# EAGLE design SpringReverbRev2.1_SMD (EAGLE 9.6.2)
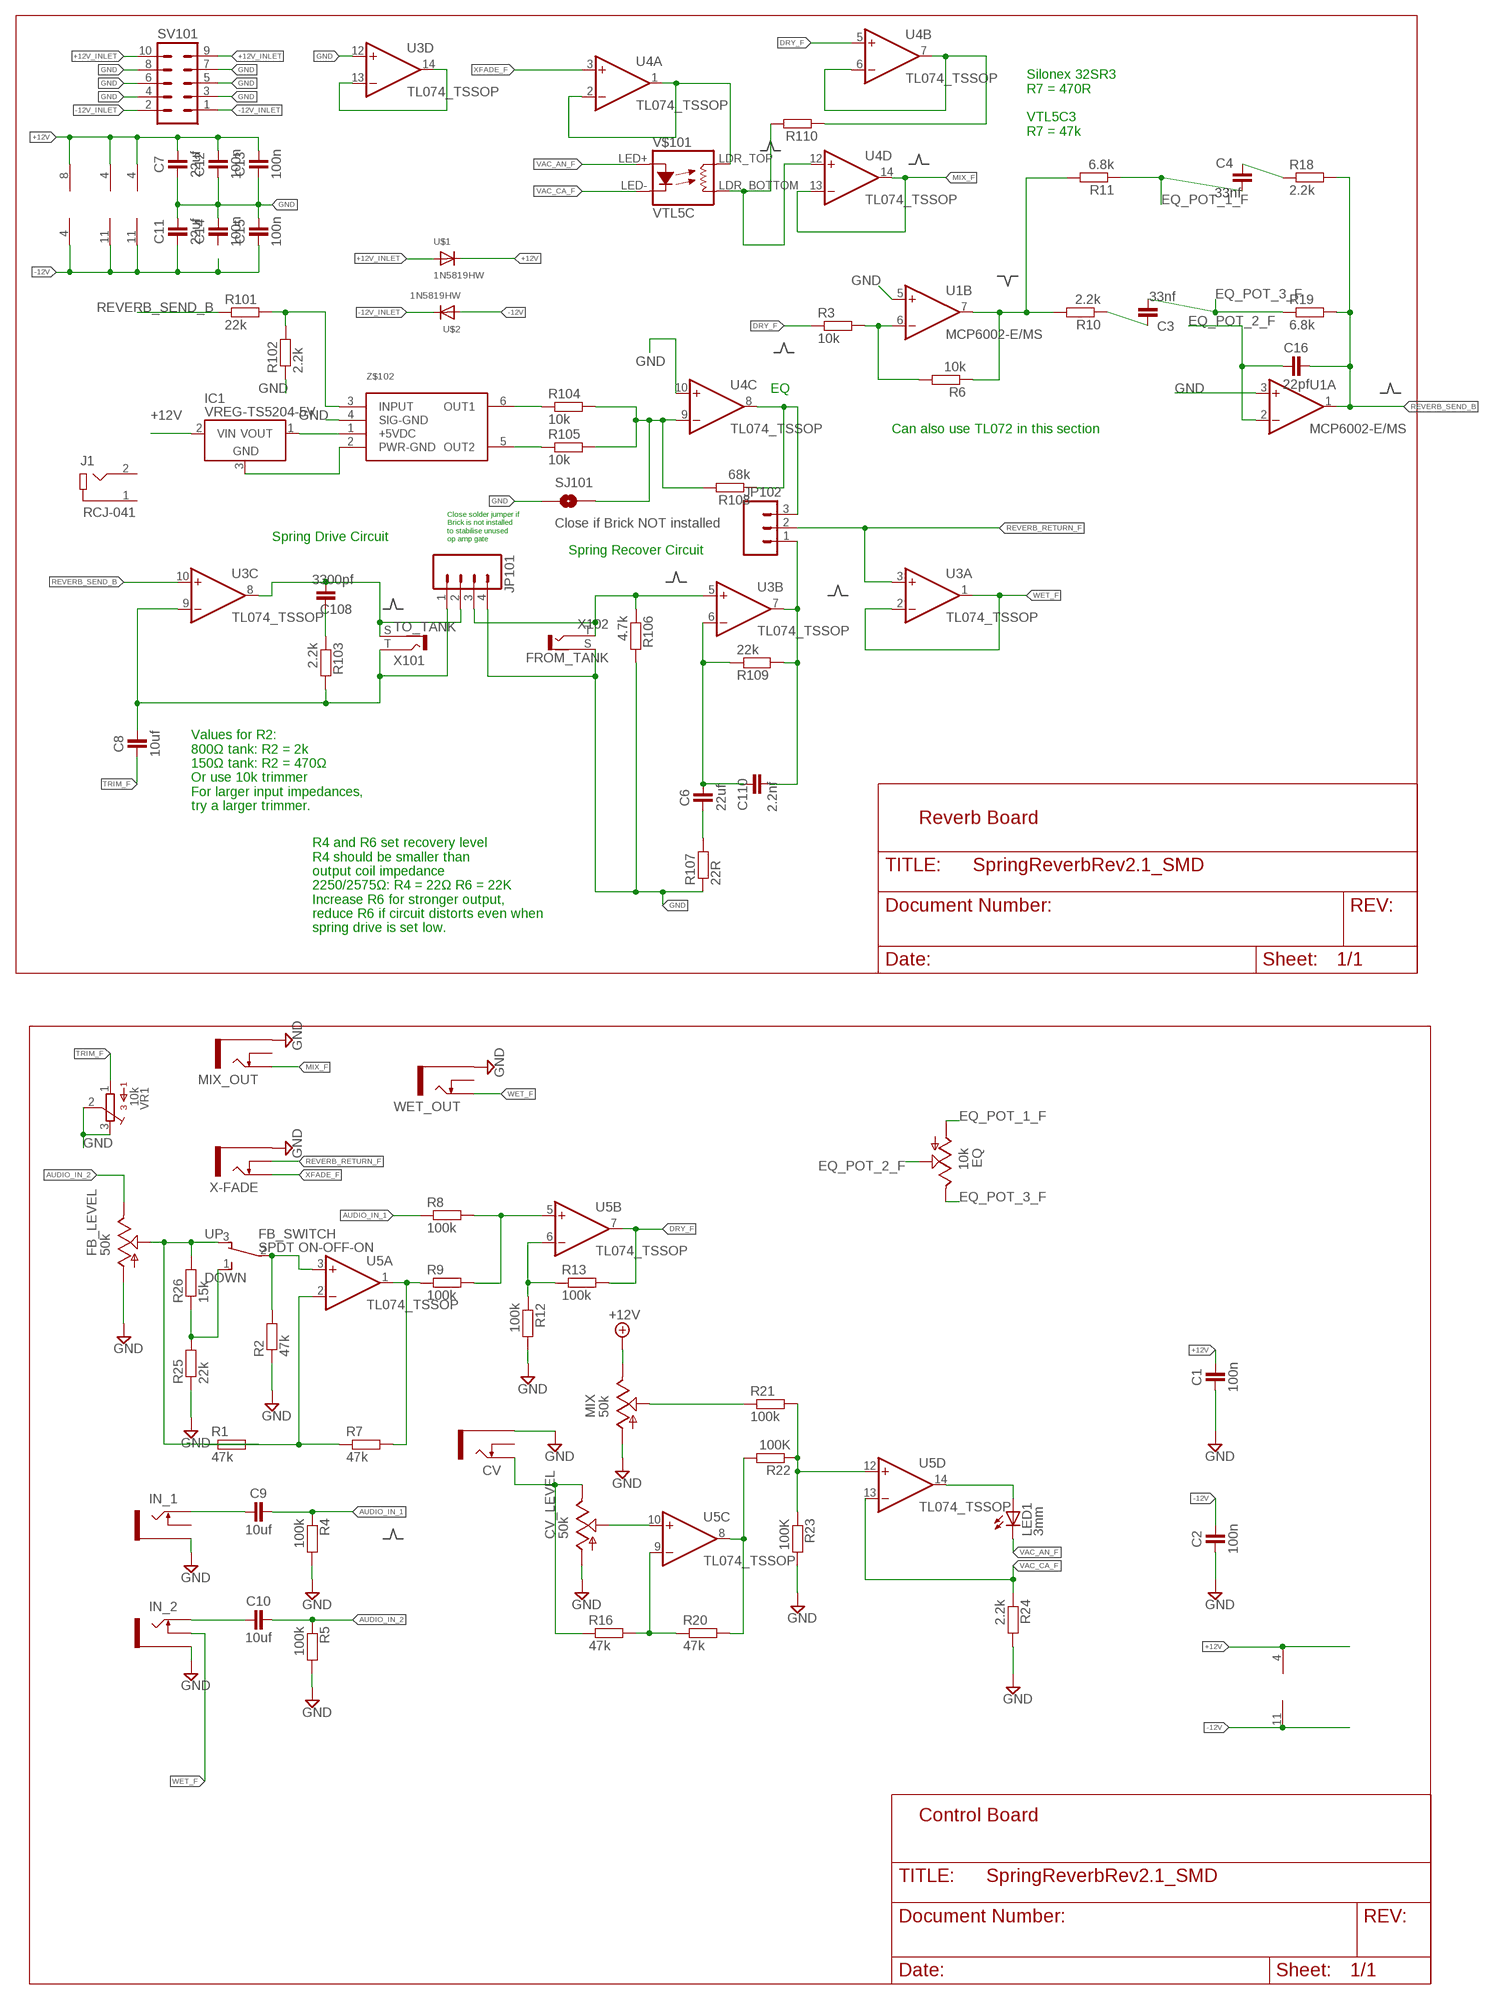
[diagram p0: schematic, sheet 1]

## Parts
C1  100n  CAPACITOR-0402  [C0402]
C2  100n  CAPACITOR-0402  [C0402]
C3  33nf  CAPACITOR-0402  [C0402]
C4  33nf  CAPACITOR-0402  [C0402]
C6  22uf  CAPACITOR-1210  [C1210]
C7  22uf  CAPACITOR-1206  [C1206]
C8  10uf  CAPACITOR-0805  [C0805]
C9  10uf  CAPACITOR-0805  [C0805]
C10  10uf  CAPACITOR-0805  [C0805]
C11  22uf  CAPACITOR-1206  [C1206]
C12  100n  CAPACITOR-0402  [C0402]
C13  100n  CAPACITOR-0402  [C0402]
C14  100n  CAPACITOR-0402  [C0402]
C15  100n  CAPACITOR-0402  [C0402]
C16  22pf  CAPACITOR-0402  [C0402]
C108  3300pf  CAPACITOR-0402  [C0402]
C110  2.2nf  CAPACITOR-0402  [C0402]
CV  THONKICONNNEW  [WQP-PJ301M-12_JACK]
CV_LEVEL  50k  ALPHA-9MMF2A  [EVUF]
EQ  10k  ALPHA-9MMF2A  [EVUF]
FB_LEVEL  50k  ALPHA-9MMF2A  [EVUF]
FB_SWITCH  SPDT ON-OFF-ON  SPDT-VERTICAL-UPTOP-SUBMINI  [SPDT-VERTICAL-TOP-SUBMINI-MULTICOMP]
IC1  VREG-TS5204-5V  [SOT23]
IN_1  THONKICONNNEW  [WQP-PJ301M-12_JACK]
IN_2  THONKICONNNEW  [WQP-PJ301M-12_JACK]
J1  RCJ-041  [RCJ-041]
JP101  M04POLAR  [MOLEX-1X4]
JP102  M03LOCK_NO_SILK  [1X03_LOCK_NO_SILK]
LED1  3mm  LED3MM  [LED3MM]
MIX  50k  ALPHA-9MMF2A  [EVUF]
MIX_OUT  THONKICONNNEW  [WQP-PJ301M-12_JACK]
R1  47k  RESISTOR-0402  [C0402]
R2  47k  RESISTOR-0402  [C0402]
R3  10k  RESISTOR-0402  [C0402]
R4  100k  RESISTOR-0402  [C0402]
R5  100k  RESISTOR-0402  [C0402]
R6  10k  RESISTOR-0402  [C0402]
R7  47k  RESISTOR-0402  [C0402]
R8  100k  RESISTOR-0402  [C0402]
R9  100k  RESISTOR-0402  [C0402]
R10  2.2k  RESISTOR-0402  [C0402]
R11  6.8k  RESISTOR-0402  [C0402]
R12  100k  RESISTOR-0402  [C0402]
R13  100k  RESISTOR-0402  [C0402]
R16  47k  RESISTOR-0402  [C0402]
R18  2.2k  RESISTOR-0402  [C0402]
R19  6.8k  RESISTOR-0402  [C0402]
R20  47k  RESISTOR-0402  [C0402]
R21  100k  RESISTOR-0402  [C0402]
R22  100K  RESISTOR-0402  [C0402]
R23  100K  RESISTOR-0402  [C0402]
R24  2.2k  RESISTOR-0402  [C0402]
R25  22k  RESISTOR-0402  [C0402]
R26  15k  RESISTOR-0402  [C0402]
R101  22k  RESISTOR-0402  [C0402]
R102  2.2k  RESISTOR-0402  [C0402]
R103  2.2k  RESISTOR-0402  [C0402]
R104  10k  RESISTOR-0402  [C0402]
R105  10k  RESISTOR-0402  [C0402]
R106  4.7k  RESISTOR-0402  [C0402]
R107  22R  RESISTOR-0402  [C0402]
R108  68k  RESISTOR-0402  [C0402]
R109  22k  RESISTOR-0402  [C0402]
R110  RESISTOR-0402  [C0402]
SJ101  Close if Brick NOT installed  SOLDERJUMPERNC2  [SJ_2S-NOTRACE]
SV101  10_PIN_HEADER  [MA05-2]
U1  MCP6002-E/MS  [SOP65P490X110-8N]
U3  TL074_TSSOP  LM324_TSSOP  [SOP65P640X120-14N]
U4  TL074_TSSOP  LM324_TSSOP  [SOP65P640X120-14N]
U5  TL074_TSSOP  LM324_TSSOP  [SOP65P640X120-14N]
U$1  1N5819HW  [SOD-123-EDITED]
U$2  1N5819HW  [SOD-123-EDITED]
V$101  VTL5C  VACTROL_COMPACT  [VACTROL_COMPACT]
VR1  10k  BOURNS_3362P_TRIMMERP  [BOURNS_3362P_TRIMMER]
WET_OUT  THONKICONNNEW  [WQP-PJ301M-12_JACK]
X101  TO_TANK  BTOR1  [BTOR1]
X102  FROM_TANK  BTOR1  [BTOR1]
X-FADE  THONKICONNNEW  [WQP-PJ301M-12_JACK]
Z$102  BTDR-2H  [BTDR-2H]

## Nets
+12V [power]: C1.2 C7.2 C12.2 C13.2 IC1.2(VIN) MIX.3(E) U1.8(PWR:V+) U3.4(PWR:V+) U4.4(PWR:V+) U5.4(PWR:V+) U$1.C
+12V_INLET: SV101.9 SV101.10 U$1.A
-12V [power]: C2.2 C11.1 C15.1 U1.4(PWR:V-) U3.11(PWR:V-) U4.11(PWR:V-) U5.11(PWR:V-) U$2.A
-12V_INLET: SV101.1 SV101.2 U$2.C
AUDIO_IN_1: C9.2 R4.1 R8.1
AUDIO_IN_2: C10.2 FB_LEVEL.3(E) R5.1
AUDIO_IN_BUF: R110.1 U4.6(B:-IN) U4.7(B:OUT)
BRK: JP102.3 R108.1 U4.8(C:OUT)
CV_F: R20.2 R22.2 U5.8(C:OUT)
DRY_F: R3.1 R13.2 U4.5(B:+IN) U5.7(B:OUT)
EQ_POT_1_F: C4.2 EQ.1(A) R11.1
EQ_POT_2_F: C16.1 EQ.2(S) U1.2(A:-IN)
EQ_POT_3_F: C3.2 EQ.3(E) R19.1
GND [ground]: C1.1 C2.1 C7.1 C11.2 C12.1 C13.1 C14.2 C15.2 CV.P$3_SLEEVE(SLEEVE) CV_LEVEL.1(A) FB_LEVEL.1(A) IN_1.P$3_SLEEVE(SLEEVE) IN_2.P$3_SLEEVE(SLEEVE) JP101.4 MIX.1(A) MIX_OUT.P$3_SLEEVE(SLEEVE) R2.1 R4.2 R5.2 R12.2 R23.2 R24.2 R25.1 R102.1 R106.2 R107.1 SJ101.1 SV101.3 SV101.4 SV101.5 SV101.6 SV101.7 SV101.8 U1.3(A:+IN) U1.5(B:+IN) U3.12(D:+IN) U4.10(C:+IN) VR1.2 VR1.3 WET_OUT.P$3_SLEEVE(SLEEVE) X102.S X-FADE.P$3_SLEEVE(SLEEVE) Z$102.4(SIG-GND)
MIX_F: MIX_OUT.P$1_TIP(TIP) U4.13(D:-IN) U4.14(D:OUT)
N$1: C9.1 IN_1.P$1_TIP(TIP)
N$2: C10.1 IN_2.P$1_TIP(TIP)
N$3: MIX.2(S) R21.1
N$4: FB_LEVEL.2(S) FB_SWITCH.3 R1.2 R26.2
N$5: R1.1 R7.1 U5.2(A:-IN)
N$6: R7.2 R9.1 U5.1(A:OUT)
N$7: R8.2 R9.2 U5.5(B:+IN)
N$8: R21.2 R22.1 R23.1 U5.12(D:+IN)
N$9: R12.1 R13.1 U5.6(B:-IN)
N$10: CV.P$1_TIP(TIP) CV_LEVEL.3(E) R16.1
N$11: LED1.A U5.14(D:OUT)
N$12: FB_SWITCH.1 R25.2 R26.1
N$13: C3.1 R10.1
N$17: C6.1 R107.2
N$19: C6.2 C110.1 R109.1 U3.6(B:-IN)
N$20: CV_LEVEL.2(S) U5.10(C:+IN)
N$21: C4.1 R18.1
N$23: R16.2 R20.1 U5.9(C:-IN)
N$24: R3.2 R6.2 U1.6(B:-IN)
N$26: C108.1 R103.1
N$27: IC1.1(VOUT) Z$102.1(+5VDC)
N$28: R104.1 Z$102.6(OUT1)
N$29: R105.1 Z$102.5(OUT2)
N$30: R104.2 R105.2 R108.2 SJ101.2 U4.9(C:-IN)
N$31: R6.1 R10.2 R11.2 U1.7(B:OUT)
N$32: R101.2 R102.2 Z$102.3(INPUT)
N$33 [ground]: IC1.3(GND) Z$102.2(PWR-GND)
N$34 [ground]: R110.2 U4.12(D:+IN) V$101.LDR_BOTTOM(RES2)
N$35: U3.13(D:-IN) U3.14(D:OUT)
N$41: FB_SWITCH.2 R2.2 U5.3(A:+IN)
R+: JP101.3 R106.1 U3.5(B:+IN) X102.T
REVERB_RETURN_F: JP102.2 U3.3(A:+IN) X-FADE.P$2_SWITCH(SWITCH)
REVERB_SEND_B: C16.2 R18.2 R19.2 R101.1 U1.1(A:OUT) U3.10(C:+IN)
S+: C8.2 JP101.1 R103.2 U3.9(C:-IN) X101.T
S-: C108.2 JP101.2 U3.8(C:OUT) X101.S
SPNG: C110.2 JP102.1 R109.2 U3.7(B:OUT)
TRIM_F: C8.1 VR1.1
VAC_AN_F: LED1.K(C) V$101.LED+
VAC_CA_F: R24.1 U5.13(D:-IN) V$101.LED-
WET_F: IN_2.P$2_SWITCH(SWITCH) U3.1(A:OUT) U3.2(A:-IN) WET_OUT.P$1_TIP(TIP)
X_FADE_IN: U4.1(A:OUT) U4.2(A:-IN) V$101.LDR_TOP(RES1)
XFADE_F: U4.3(A:+IN) X-FADE.P$1_TIP(TIP)
Unconnected: C14.1 CV.P$2_SWITCH(SWITCH) IN_1.P$2_SWITCH(SWITCH) J1.1 J1.2 MIX_OUT.P$2_SWITCH(SWITCH) WET_OUT.P$2_SWITCH(SWITCH) X101.S@1 X101.S@2 X101.S@3 X102.S@1 X102.S@2 X102.S@3

## Notes on the sheet
- Silonex 32SR3 
  R7 = 470R
  
  VTL5C3 
  R7 = 47k
- EQ
- Can also use TL072 in this section
- Spring Drive Circuit
- Close solder jumper if 
  Brick is not installed
  to stabilise unused
  op amp gate
- Spring Recover Circuit
- Values for R2:
  800Ω tank: R2 = 2k
  150Ω tank: R2 = 470Ω
  Or use 10k trimmer
  For larger input impedances, 
  try a larger trimmer.
- Reverb Board
- R4 and R6 set recovery level 
  R4 should be smaller than 
  output coil impedance
  2250/2575Ω: R4 = 22Ω R6 = 22K 
  Increase R6 for stronger output, 
  reduce R6 if circuit distorts even when 
  spring drive is set low.
- Control Board

## Library data of the parts
C1-C4 C6-C16 C108 C110 = we-rcl:CAPACITOR: Capacitors ...2.2uF @ 6.3V -> 0402 ...4.7uF @ 6.3V -> 0603 ...10uF @ 16V -> 0805 ...22uF @ 25V -> 1206
CV IN_1 IN_2 MIX_OUT WET_OUT X-FADE = MusicThingModular:THONKICONN: 3.5mm socket for Eurorack modular synths
CV_LEVEL EQ FB_LEVEL MIX = TomW:ALPHA-9MM: 9 mm Square Rotary Potentiometers Source: Panasonic
FB_SWITCH = Monowave_Switches:SPDT-VERTICAL-UP: Vertical SPDT switch in the up position.; SPICE: R{NAME} {2.NET} {3.NET} 1
IC1 = we-power:VREG: Voltage Regulators (LDOs, Switching Converters...) LDOs Taiwan Semi TS1117 800mA max 15V - compatible On Semi NCP1117 1A max 20V Taiwan Semi TS9011 250mA max 12V - compatible Diodes AP2210 300mA max 15V - compatible Microchip MCP1702 250mA max 13V - compatible Microchip MCP1703 250mA max 16V - compatible Microchip MCP1754 150mA max 16V Taiwan Semi TS5204 150mA max 16V (low noise) DC/DC Converter Modules Recom R-78Ex.x-1.0-W36 1A max 28V Murata OKI-78SR-x.x/1.5-W36 1.5A max 36V CUI V78xx-2000 2A max 18V; NRND: NRND
J1 = Connectors:RCJ-041: CONN RCA JACK MONO 3.2MM R/A Manufacturer's datasheet <https://www.cui.com/product/resource/digikeypdf/rcj-04x.pdf>; CREATED_BY: PCBLayout.com; DIGIKEY_PART_NUMBER: CP-1418-ND; MANUFACTURER: CUI Inc.; MPN: RCJ-041
JP101 = SparkFun-Connectors:M04: Header 4 Standard 4-pin 0.1" header. Use with straight break away headers (SKU : PRT-00116), right angle break away headers (PRT-00553), swiss pins (PRT-00743), machine pins (PRT-00117), and female headers (PRT-00115). Molex polarized connector foot print use with SKU : PRT-08231 with associated crimp pins and housings. 1MM SMD Version SKU: PRT-10208
JP102 = SparkFun-Connectors:M03: Header 3 Standard 3-pin 0.1" header. Use with straight break away headers (SKU : PRT-00116), right angle break away headers (PRT-00553), swiss pins (PRT-00743), machine pins (PRT-00117), and female headers (PRT-00115). Molex polarized connector foot print use with SKU : PRT-08232 with associated crimp pins and housings.
LED1 = TomW:LED: LED OSRAM: - CHIPLED LG R971, LG N971, LY N971, LG Q971, LY Q971, LO R971, LY R971 LH N974, LH R974 LS Q976, LO Q976, LY Q976 LO Q996 - Hyper CHIPLED LW Q18S LB Q993, LB Q99A, LB R99A - SideLED LS A670, LO A670, LY A670, LG A670, LP A670 LB A673, LV A673, LT A673, LW A673 LH A674 LY A675 LS A676, LA A676, LO A676, LY A676, LW A676 LS A679, LY A679, LG A679 - Hyper Micro SIDELED® LS Y876, LA Y876, LO Y876, LY Y876 LT Y87S - SmartLED LW L88C, LW L88S LB L89C, LB L89S, LG L890 LS L89K, LO L89K, LY L89K LS L896, LA L896, LO L896, LY L896 - TOPLED LS T670, LO T670, LY T670, LG T670, LP T670 LSG T670, LSP T670, LSY T670, LOP T670, LYG T670 LG T671, LOG T671, LSG T671 LB T673, LV T673, LT T673, LW T673 LH T674 LS T676, LA T676, LO T676, LY T676, LB T676, LH T676, LSB T676, LW T676 LB T67C, LV T67C, LT T67C, LS T67K, LO T67K, LY T67K, LW E67C LS E67B, LA E67B, LO E67B, LY E67B, LB E67C, LV E67C, LT E67C LW T67C LS T679, LY T679, LG T679 LS T770, LO T770, LY T770, LG T770, LP T770 LB T773, LV T773, LT T773, LW T773 LH T774 LS E675, LA E675, LY E675, LS T675 LS T776, LA T776, LO T776, LY T776, LB T776 LHGB T686 LT T68C, LB T68C - Hyper Mini TOPLED® LB M676 - Mini TOPLED Santana® LG M470 LS M47K, LO M47K, LY M47K Source: http://www.osram.convergy.de LUXEON: - LUMILED® LXK2-PW12-R00, LXK2-PW12-S00, LXK2-PW14-U00, LXK2-PW14-V00 LXK2-PM12-R00, LXK2-PM12-S00, LXK2-PM14-U00 LXK2-PE12-Q00, LXK2-PE12-R00, LXK2-PE12-S00, LXK2-PE14-T00, LXK2-PE14-U00 LXK2-PB12-K00, LXK2-PB12-L00, LXK2-PB12-M00, LXK2-PB14-N00, LXK2-PB14-P00, LXK2-PB14-Q00 LXK2-PR12-L00, LXK2-PR12-M00, LXK2-PR14-Q00, LXK2-PR14-R00 LXK2-PD12-Q00, LXK2-PD12-R00, LXK2-PD12-S00 LXK2-PH12-R00, LXK2-PH12-S00 LXK2-PL12-P00, LXK2-PL12-Q00, LXK2-PL12-R00 Source: www.luxeon.com KINGBRIGHT: KA-3528ASYC Source: www.kingbright.com
R1-R13 R16 R18-R26 R101-R110 = we-rcl:RESISTOR: Resistors all kinds in 0402 and 0603
SJ101 = SparkFun-Passives:SOLDERJUMPER: Solder Jumper Standard SMD solder jumper. Used to automate production. Two varients : Normally Open and Normally Closed are the same, but have different paste layers. NC will have a large amount of paste and should jumper during reflow.
SV101 = TomW:10_PIN_HEADER: PIN HEADER; OC_FARNELL: unknown; OC_NEWARK: unknown
U1 = MTM_untested:MCP6002-E/MS: Low-Power Op Amp; MPN: MCP6002-E/MS; OC_FARNELL: 1840886; OC_NEWARK: 88H9854; PACKAGE: SOP-8; SUPPLIER: Microchip
U3-U5 = MTM_untested:LM324_TSSOP: IC OPAMP QUAD 1.8V; MPN: MCP6004-I/ST; OC_FARNELL: 8540861; OC_NEWARK: 72C4277; PACKAGE: 14TSSOP; SUPPLIER: Microchip
U$1 U$2 = MTM_untested:1N5819HW
V$101 = TomW:VACTROL_COMPACT
VR1 = MusicThingModular:BOURNS_3362P_TRIMMER: 3362 Series 1/4" Square Trimmer
X101 X102 = con-lumberg:BTOR1: RCA connectors according to JEITA RC-5231 Cinch RCA-Einbaukupplung nach JEITA RC-5231, stehende Ausführung Source: http://www.lumberg.de/Produkte/PDFs/BTOR1.pdf; MPN: BTOR 1; OC_FARNELL: 1217030; OC_NEWARK: 96K7172
Z$102 = Accutronics BTDR-2H:BTDR-2H: Accutronics BTDR-2H Information: http://www.accutronicsreverb.com/main/?skin=sub01_05_1.html

## Net classes
0 default: width 0.203 mm
1 power: width 0.406 mm

## Board
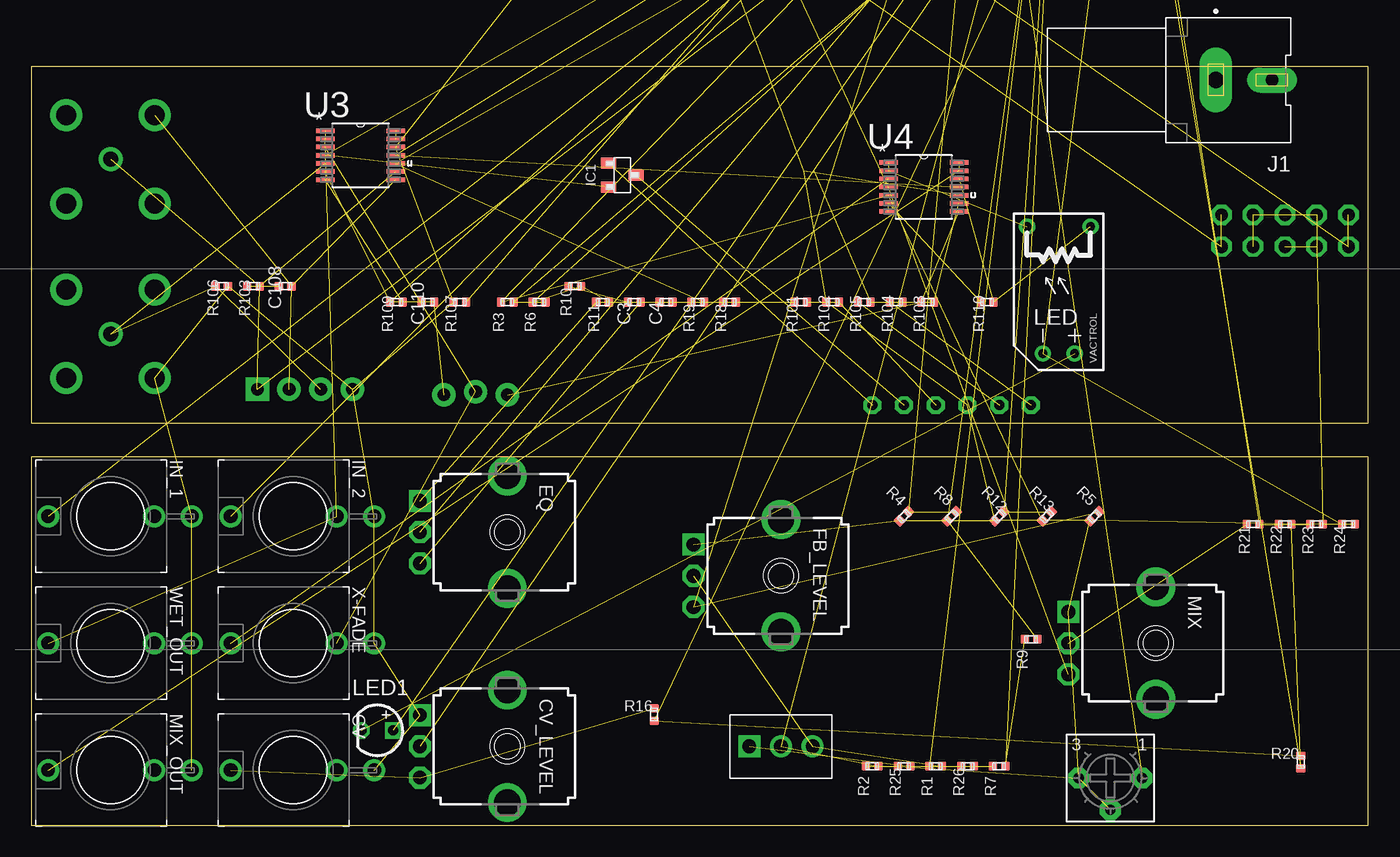
[diagram p1: board, top side]
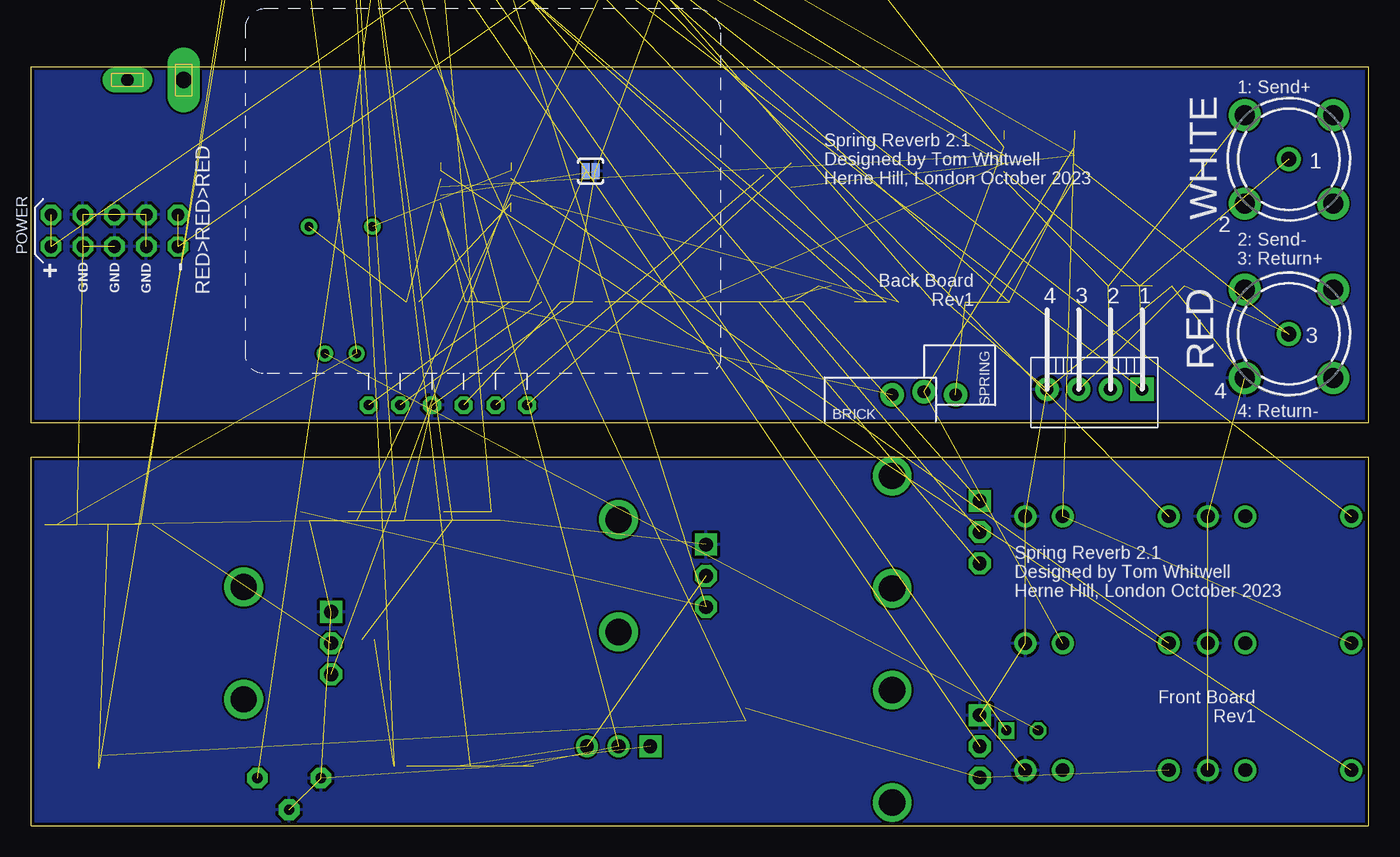
[diagram p2: board, bottom side, seen from below]

Size 107 x 60.75 mm. Coordinates in mm from the lower left corner, seen from the top.
Outline: 107,0 107,29.5 0,29.5 0,0 107,0
Outline: 0,60.75 0,32.25 107,32.25 107,60.75 0,60.75
Copper layers (1*16): Top 0.035mm / dielectric 0.2mm / Bottom 0.035mm
Design rules "SeeedStudio_DRU_no_angle_20130527 *": minimum track width 6mil, minimum drill 12mil, track to track 6mil, track to pad 6mil, pad to pad 6mil, via to via 6mil, smd to smd 0mil, copper to edge 10mil, drill to drill 10mil, minimum pad ring 6mil, minimum via ring 6mil, stop-mask expansion 2mil, vias tented up to drill 25mil, thermal gap 10mil

### Footprints (pad centres in the part's own frame; a part is rotated, then mirrored left to right if it is on the bottom)
C0402 = smd 0.75 x 0.7: 1 0,0.5; 2 0,-0.5
C1210 = smd 2.7 x 1.45: 1 0,1.4; 2 0,-1.35
C1206 = smd 1.8 x 1.45: 1 0,1.4; 2 0,-1.4
C0805 = smd 1.5 x 1.25: 1 0,0.95; 2 0,-0.95
WQP-PJ301M-12_JACK = drill 1.1: P$1_TIP 0,5; P$2_SWITCH 0,-3.5; P$3_SLEEVE 0,-6.5
EVUF = drill 1.1 square: 1 -2.5,-7 | drill 1.1 octagon: 2 0,-7; 3 2.5,-7 | drill 2.1: M1 4.5,0; M2 -4.5,0
SPDT-VERTICAL-TOP-SUBMINI-MULTICOMP = drill 1.1 square: 1 0,2.54 | drill 1.1: 2 0,0; 3 0,-2.54
SOT23 = smd 1.3 x 0.9: 1 -1.1,0.95; 2 -1.1,-0.95; 3 1.1,0
RCJ-041 = drill 1.3 pad 2.6 long: 1 -4,0 | drill 1 pad 2 long: 2 -8.5,0
MOLEX-1X4 = drill 1.016 pad 1.88 square: 1 0,0 | drill 1.016 pad 1.88: 2 2.54,0; 3 5.08,0; 4 7.62,0
1X03_LOCK_NO_SILK = drill 1.016 pad 1.88: 1 0,0.127; 2 2.54,-0.127; 3 5.08,0.127
LED3MM = drill 0.813 square: A -1.27,0 | drill 0.813 octagon: K 1.27,0
SJ_2S-NOTRACE = smd 0.635 x 1.27: 1 -0.401,0; 2 0.413,0
MA05-2 = drill 1.016 octagon: 1 -5.08,-1.27; 2 -5.08,1.27; 3 -2.54,-1.27; 4 -2.54,1.27; 5 0,-1.27; 6 0,1.27; 7 2.54,-1.27; 8 2.54,1.27; 9 5.08,-1.27; 10 5.08,1.27
SOP65P490X110-8N = smd 1.524 x 0.457: 1 -2.032,0.965; 2 -2.032,0.33; 3 -2.032,-0.33; 4 -2.032,-0.965; 5 2.032,-0.965; 6 2.032,-0.33; 7 2.032,0.33; 8 2.032,0.965
SOP65P640X120-14N = smd 1.473 x 0.356: 1 -2.819,1.956; 2 -2.819,1.295; 3 -2.819,0.66; 4 -2.819,0; 5 -2.819,-0.66; 6 -2.819,-1.295; 7 -2.819,-1.956; 8 2.819,-1.956; 9 2.819,-1.295; 10 2.819,-0.66; 11 2.819,0; 12 2.819,0.66; 13 2.819,1.295; 14 2.819,1.956
SOD-123-EDITED = smd 0.95 x 0.9: A 1.575,0; C -1.575,0
VACTROL_COMPACT = drill 0.7 pad 1.3: LDR_BOTTOM 5.08,-2.54; LDR_TOP 5.08,2.54; LED+ -5.08,-1.27; LED- -5.08,1.27
BOURNS_3362P_TRIMMER = drill 0.813 pad 1.676 octagon: 1 -2.54,0; 2 0,2.54; 3 2.54,0
BTOR1 = drill 1.6 pad 2.2: S -5,0; S@1 0,5; S@2 5,0; S@3 0,-5 | drill 1.2 pad 1.6: T 0,0
BTDR-2H = drill 0.8 pad 1.422 octagon: 1 2.54,-17.78; 2 0,-17.78; 3 -2.54,-17.78; 4 -5.08,-17.78; 5 -7.62,-17.78; 6 -10.16,-17.78

### Placement (x,y rotation side)
C1  69.85,82.23 0 top  (outside the outline)
C2  65.72,82.23 0 top  (outside the outline)
C3  48.26,41.91 90 top
C4  50.8,41.91 90 top
C6  66.67,77.15 0 top  (outside the outline)
C7  61.28,68.26 0 top  (outside the outline)
C8  77.47,81.6 0 top  (outside the outline)
C9  75.25,81.6 0 top  (outside the outline)
C10  73.03,81.6 0 top  (outside the outline)
C11  56.52,68.26 0 top  (outside the outline)
C12  52.07,68.26 0 top  (outside the outline)
C13  47.94,68.26 0 top  (outside the outline)
C14  43.81,68.26 0 top  (outside the outline)
C15  39.69,68.26 0 top  (outside the outline)
C16  35.56,68.26 0 top  (outside the outline)
C108  20.32,43.18 90 top
C110  31.75,41.91 90 top
CV  20.95,4.45 90 top
CV_LEVEL  38.1,6.35 270 top
EQ  38.1,23.5 270 top
FB_LEVEL  60,20 270 top
FB_SWITCH  60,6.35 90 top
IC1  47.31,52.07 0 top
IN_1  6.35,24.77 90 top
IN_2  20.95,24.77 90 top
J1  90.81,59.69 180 top
JP101  18.1,34.92 180 bottom
JP102  33.02,34.61 180 bottom
LED1  27.69,7.62 180 top
MIX  90,14.61 270 top
MIX_OUT  6.35,4.45 90 top
R1  72.39,4.76 90 top
R2  67.31,4.76 90 top
R3  38.1,41.91 90 top
R4  69.85,24.77 315 top
R5  85.09,24.77 315 top
R6  40.64,41.91 90 top
R7  77.47,4.76 90 top
R8  73.66,24.77 315 top
R9  80.01,14.92 90 top
R10  43.5,43.18 90 top
R11  45.72,41.91 90 top
R12  77.47,24.77 315 top
R13  81.28,24.77 315 top
R16  49.85,8.89 0 top
R18  55.88,41.91 90 top
R19  53.34,41.91 90 top
R20  101.6,5.08 0 top
R21  97.79,24.13 90 top
R22  100.33,24.13 90 top
R23  102.87,24.13 90 top
R24  105.41,24.13 90 top
R25  69.85,4.76 90 top
R26  74.93,4.76 90 top
R101  61.59,41.91 90 top
R102  64.14,41.91 90 top
R103  17.78,43.18 90 top
R104  69.22,41.91 90 top
R105  66.67,41.91 90 top
R106  15.24,43.18 90 top
R107  34.29,41.91 90 top
R108  71.75,41.91 90 top
R109  29.21,41.91 90 top
R110  76.52,41.91 90 top
SJ101  62.23,52.39 180 bottom
SV101  100.33,47.62 180 bottom
U1  82.23,81.28 0 top  (outside the outline)
U3  26.35,53.66 0 top
U4  71.44,51.12 0 top
U5  85.09,90.17 0 top  (outside the outline)
U$1  66.04,72.71 0 top  (outside the outline)
U$2  66.04,67.94 0 top  (outside the outline)
V$101  82.23,42.86 90 top
VR1  86.36,3.81 180 top
WET_OUT  6.35,14.61 90 top
X101  6.35,53.34 315 bottom
X102  6.35,39.37 45 bottom
X-FADE  20.95,14.61 90 top
Z$102  69.85,51.44 0 bottom

### Tracks (layer width: path | path; a pad name or v marks a point on that pad's centre or on a via)
+12V  (10 unrouted)
+12V_INLET  (2 unrouted)
-12V  (7 unrouted)
-12V_INLET  (2 unrouted)
AUDIO_IN_1  (2 unrouted)
AUDIO_IN_2  (2 unrouted)
AUDIO_IN_BUF  (2 unrouted)
BRK  (2 unrouted)
CV_F  (2 unrouted)
DRY_F  (3 unrouted)
EQ_POT_1_F  (2 unrouted)
EQ_POT_2_F  (2 unrouted)
EQ_POT_3_F  (2 unrouted)
GND  (42 unrouted)
  pour Bottom: -0.32,29.53 107,29.53 107,0 0,0
  pour Bottom: -0.32,32.07 107.31,32.07 107.31,60.96 -0.32,60.96
MIX_F  (2 unrouted)
N$1  (1 unrouted)
N$2  (1 unrouted)
N$3  (1 unrouted)
N$4  (3 unrouted)
N$5  (2 unrouted)
N$6  (2 unrouted)
N$7  (2 unrouted)
N$8  (3 unrouted)
N$9  (2 unrouted)
N$10  (2 unrouted)
N$11  (1 unrouted)
N$12  (2 unrouted)
N$13  (1 unrouted)
N$17  (1 unrouted)
N$19  (3 unrouted)
N$20  (1 unrouted)
N$21  (1 unrouted)
N$23  (2 unrouted)
N$24  (2 unrouted)
N$26  (1 unrouted)
N$27  (1 unrouted)
N$28  (1 unrouted)
N$29  (1 unrouted)
N$30  (4 unrouted)
N$31  (3 unrouted)
N$32  (2 unrouted)
N$33  (1 unrouted)
N$34  (2 unrouted)
N$35  (1 unrouted)
N$41  (2 unrouted)
R+  (3 unrouted)
REVERB_RETURN_F  (2 unrouted)
REVERB_SEND_B  (5 unrouted)
S+  (4 unrouted)
S-  (3 unrouted)
SPNG  (3 unrouted)
TRIM_F  (1 unrouted)
VAC_AN_F  (1 unrouted)
VAC_CA_F  (2 unrouted)
WET_F  (3 unrouted)
X_FADE_IN  (2 unrouted)
XFADE_F  (1 unrouted)

### Text on the board
bPlace: WHITE | Spring Reverb 2.1 / Designed by Tom Whitwell / Herne Hill, London October 2023 | 1 | 2 | 1 | 2 | 3 | 4 | Back Board / Rev1 | 3 | SPRING | RED | 4 | 1: Send+ / / / / / / / / 2: Send- / 3: Return+ / / / / / / / / 4: Return- | BRICK | Spring Reverb 2.1 / Designed by Tom Whitwell / Herne Hill, London October 2023 | Front Board / Rev1